# Altium schematic sheet Controller_Board_Power_Supply.SchDoc: Controller Board Power Supply
size Letter; Author: Kevin Chen, Aleksa, Yifei Li; DrawnBy: Kevin Chen, Yifei Li; Engineer: Kevin Chen, Yifei Li; Revision: 3.0; SheetNumber: 2; SheetTotal: 2; Website: www.uwmidsun.com
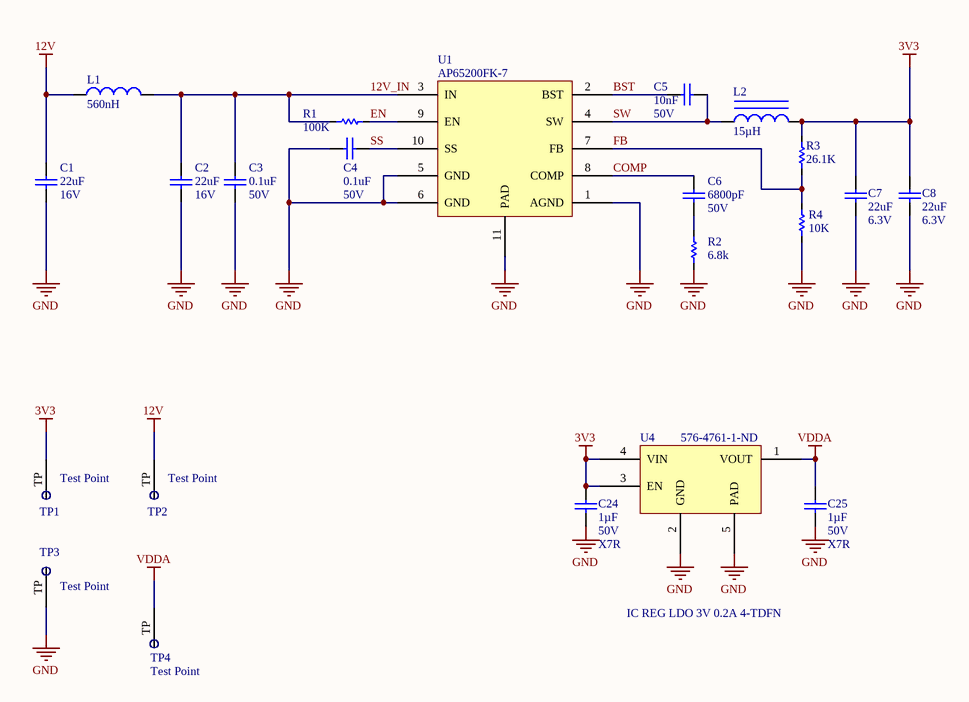
[diagram p0: Controller_Board_Power_Supply.SchDoc]

## Parts
C1  22uF  Voltage: 16V  [CAPC3225X28M]
C2  22uF  Voltage: 16V  [CAPC3225X28M]
C3  0.1uF  Voltage: 50V  [CAPC1608X06N]
C4  0.1uF  Voltage: 50V  [CAPC1608X06N]
C5  10nF  Voltage: 50V  [CAPC1608X06N]
C6  6800pF  Voltage: 50V  [CAPC1608X06N]
C7  22uF  Voltage: 6.3V  [CAPC3216X18N]
C8  22uF  Voltage: 6.3V  [CAPC3216X18N]
C24  Capacitance: 1µF  Voltage: 50V  Temperature Coefficient: X7R  [CAP, 0603]  (hidden comment: CAP CER 1UF 50V 10% X7R 0603)
C25  Capacitance: 1µF  Voltage: 50V  Temperature Coefficient: X7R  [CAP, 0603]  (hidden comment: CAP CER 1UF 50V 10% X7R 0603)
L1  560nH  [INDC2116X06N]
L2  15µH  [IND_BOURNS_SRR40]
R1  100K  [RESC1608X06N]
R2  6.8k  [RESC1608X06N]
R3  26.1K  [RESC1608X06N]
R4  10K  [RESC1608X06N]
TP1  Test Point  [Test Point]
TP2  Test Point  [Test Point]
TP3  Test Point  [Test Point]
TP4  Test Point  [Test Point]
U1  Manufacturer Part Number: AP65200FK-7  [10-UFDFN]  (hidden comment: AP65200FK-7 Buck Switching Regulator)
U4  IC REG LDO 3V 0.2A 4-TDFN  Supplier Part Number 1: 576-4761-1-ND  [IC REG LDO 3V 0.2A 4-TDFN]

## Nets
3V3: C7.2 C8.2 C24.1 L2.2 R3.2 TP1.TP U4.3(EN) U4.4(VIN)
12V: C1.2 L1.1 TP2.TP
GND: C1.1 C2.1 C3.1 C4.2 C7.1 C8.1 C24.2 C25.2 R2.1 R4.1 TP3.TP U1.1(AGND) U1.5(GND) U1.6(GND) U1.11(PAD) U4.2(GND) U4.5(PAD)
VDDA: C25.1 TP4.TP U4.1(VOUT)
12V_IN: C2.2 C3.2 L1.2 R1.1 U1.3(IN)
BST: C5.1 U1.2(BST)
COMP: C6.2 U1.8(COMP)
EN: R1.2 U1.9(EN)
FB: R3.1 R4.2 U1.7(FB)
SS: C4.1 U1.10(SS)
SW: C5.2 L2.1 U1.4(SW)
NetC6_1: C6.1 R2.2

## Notes on the sheet
- Project:
- Title:
- Size:
- Project Lead:
- Letter
- Revision:
- University of Waterloo
- 200 University Ave W
- Waterloo, ON, Canada
- N2L 3E9
- Date:
- Sheet
- of
- Website:

## Library data of the parts
C1 C2 = CAP CER 22UF 16V X5R 1210: 22µF ±20% 16V Ceramic Capacitor X5R 1210 (3225 Metric); Manufacturer: Murata; ManufacturerPartNumber: GRM32ER61C226ME20L; Value: 22uF; Supplier: Digi-Key; SupplierPartNumber: 490-1881-1-ND
C3 C4 = CAP CER 0.1UF 50V 10% X7R 0603: 0.10µF ±10% 50V Ceramic Capacitor X7R 0603 (1608 Metric); Manufacturer: AVX Corporation; ManufacturerPartNumber: 06035C104KAT2A; Value: 0.1uF; Supplier: Digi-Key; SupplierPartNumber: 478-5052-1-ND
C5 = CAP CER 10nF 50V 5% X7R 0603: 10000pF ±5% 50V Ceramic Capacitor U2J 0603 (1608 Metric); Manufacturer: Kemet; ManufacturerPartNumber: C0603C103J5JAC7867; Value: 10nF; Supplier: Digi-Key; SupplierPartNumber: 399-13384-1-ND
C6 = CAP CER 6800pF 50V 10% X7R 0603: 6800pF ±10% 50V Ceramic Capacitor X7R 0603 (1608 Metric); Manufacturer: Samsung Electro-Mechanics America, Inc.; ManufacturerPartNumber: CL10B682KB8SFNC; Value: 6800pF; Supplier: Digi-Key; SupplierPartNumber: 1276-2103-1-ND
C7 C8 = CAP CER 22UF 6.3V X7R 1206: 22µF ±10% 6.3V Ceramic Capacitor X7R 1206 (3216 Metric); Manufacturer: Murata; ManufacturerPartNumber: GRM31CR70J226KE19L; Value: 22uF; Supplier: Digi-Key; SupplierPartNumber: 490-6515-1-ND
C24 C25 = CAP CER 1UF 50V 10% X7R 0603: 1µF ±10% 50V Ceramic Capacitor X7R 0603 (1608 Metric); Manufacturer 1: Taiyo Yuden; Manufacturer Part Number 1: UMK107AB7105KA-T; Supplier 1: Digi-Key; Supplier Part Number 1: 587-3247-1-ND; Packaging: Cut Tape (CT); Part Status: Active; Operating Temperature: -55°C ~ 125°C; Ratings: -; Mounting Type: Surface Mount, MLCC; Package / Case: 0603 (1608 Metric); Size / Dimension: 0.063" L x 0.031" W (1.60mm x 0.80mm); Height - Seated (Max): -; Thickness (Max): 0.037" (0.95mm); Lead Spacing: -; Lead Style: -; ComponentLink1URL: http://www.yuden.co.jp/productdata/catalog/en/mlcc_all_e.pdf; ComponentLink1Description: http://www.yuden.co.jp/productdata/catalog/en/mlcc_all_e.pdf; Tolerance: ±10%
L1 = IND 560NH 2.1A 80 MOHM SMD: 560nH Shielded Multilayer Inductor 2.1A 80 mOhm Max 0806 (2016 Metric); Manufacturer: Wurth Electronics Inc.; Manufacturer Part Number: 74479977156; Supplier: Digi-Key; SupplierPartNumber: 445-15776-1-ND; Current Rating: 2.1A; DC Resistance (DCR): 80 mOhm Max; Value: 560nH
L2 = IND 15UH 1.03A 220 MOHM: 15µH Shielded Wirewound Inductor 1.03A 220 mOhm Max 1919 (4848 Metric); Manufacturer: Bourns Inc.; Manufacturer Part Number: SRR4018-150Y; Tolerance: ±30%; Current - Saturation: 820mA; Supplier 1: Digi-Key; Supplier Part Number 1: SRR4018-150YCT-ND; Type: Wirewound; Current Rating: 1.03A; DC Resistance (DCR): 220 mOhm Max; Height - Seated (Max): 0.079" (2.00mm); Inductance: 15µH
R1 = RES 100K OHM 1/8W 5% 0603 SMD: RES SMD 100K OHM 5% 1/10W 0603; ManufacturerPartNumber: RC0603JR-07100KL; Manufacturer: Yageo; Value: 100K; Supplier: Digi-Key; SupplierPartNumber: 311-100KGRCT-ND
R2 = RES 6.8k OHM 1% 1/10W 0603 SMD: RES SMD 6.8K OHM 1% 1/10W 0603; ManufacturerPartNumber: RMCF0603FT6K80; Manufacturer: Stackpole Electronics Inc.; Value: 6.8k; Supplier: Digi-Key; Supplier Part Number: RMCF0603FT6K80CT-ND
R3 = RES 26.1K OHM 1/10W 1% 0603 SMD: RES SMD 26.1K OHM 1% 1/10W 0603; ManufacturerPartNumber: RC0603FR-0726K1L; Manufacturer: Yageo; Value: 26.1K; Supplier: Digi-Key; SupplierPartNumber: 311-26.1KHRCT-ND
R4 = RES SMD 10K OHM 1% 1/10W 0603: Manufacture: Yageo; Manufacture Part Number: RC0603FR-0710KL; Tolerance: 1%; Power: 1/10W; Package: 0603; Supplier: Digi-Key; Supplier Part Number: 311-10.0KHRTR-ND; Value: 10K
U1 = AP65200FK-7 Buck Switching Regulator: Buck Switching Reg IC Positive Adjustable 0.925V 1 Output 2A 10-UFDFN Exposed Pad; Digikey Part Number: AP65200FK-7DICT-ND; Supplier 1: Digi-Key; Supplier Part Number 1: AP65200FK-7DICT-ND
U4 = IC REG LDO 3V 0.2A 4-TDFN: Manufacturer: Microchip Technology; Manufacturer Part Number: MIC94310-PYMT-TR; Regulator Topology: Positive Fixed; Current - Output: 200mA; Voltage - Dropout (Typical): 0.04V @ 200mA; Voltage - Input: Up to 3.6V; Current - Limit (Min): 250mA; Supplier 1: Digi-Key; RoHS: RoHS Compliant; Category: Integrated Circuits (ICs); Stock 1: 4802; Pricing 1: 1=0.45, 25=0.3708, 100=0.3386 (CAD); Packaging: Cut Tape (CT); Part Status: Active; Voltage - Output: 3V; Operating Temperature: -40°C ~ 125°C; Mounting Type: Surface Mount; Package / Case: 4-UFDFN Exposed Pad; Supplier Device Package: 4-TDFN (1.2x1.6); ComponentLink1URL: http://www.microchip.com/mymicrochip/filehandler.aspx?ddocname=en580409; ComponentLink1Description: http://www.microchip.com/mymicrochip/filehandler.aspx?ddocname=en580409